# Altium schematic sheet MicroController.SchDoc: MicroController
size 292 x 193 mm; SheetNumber: 3; SheetTotal: 5
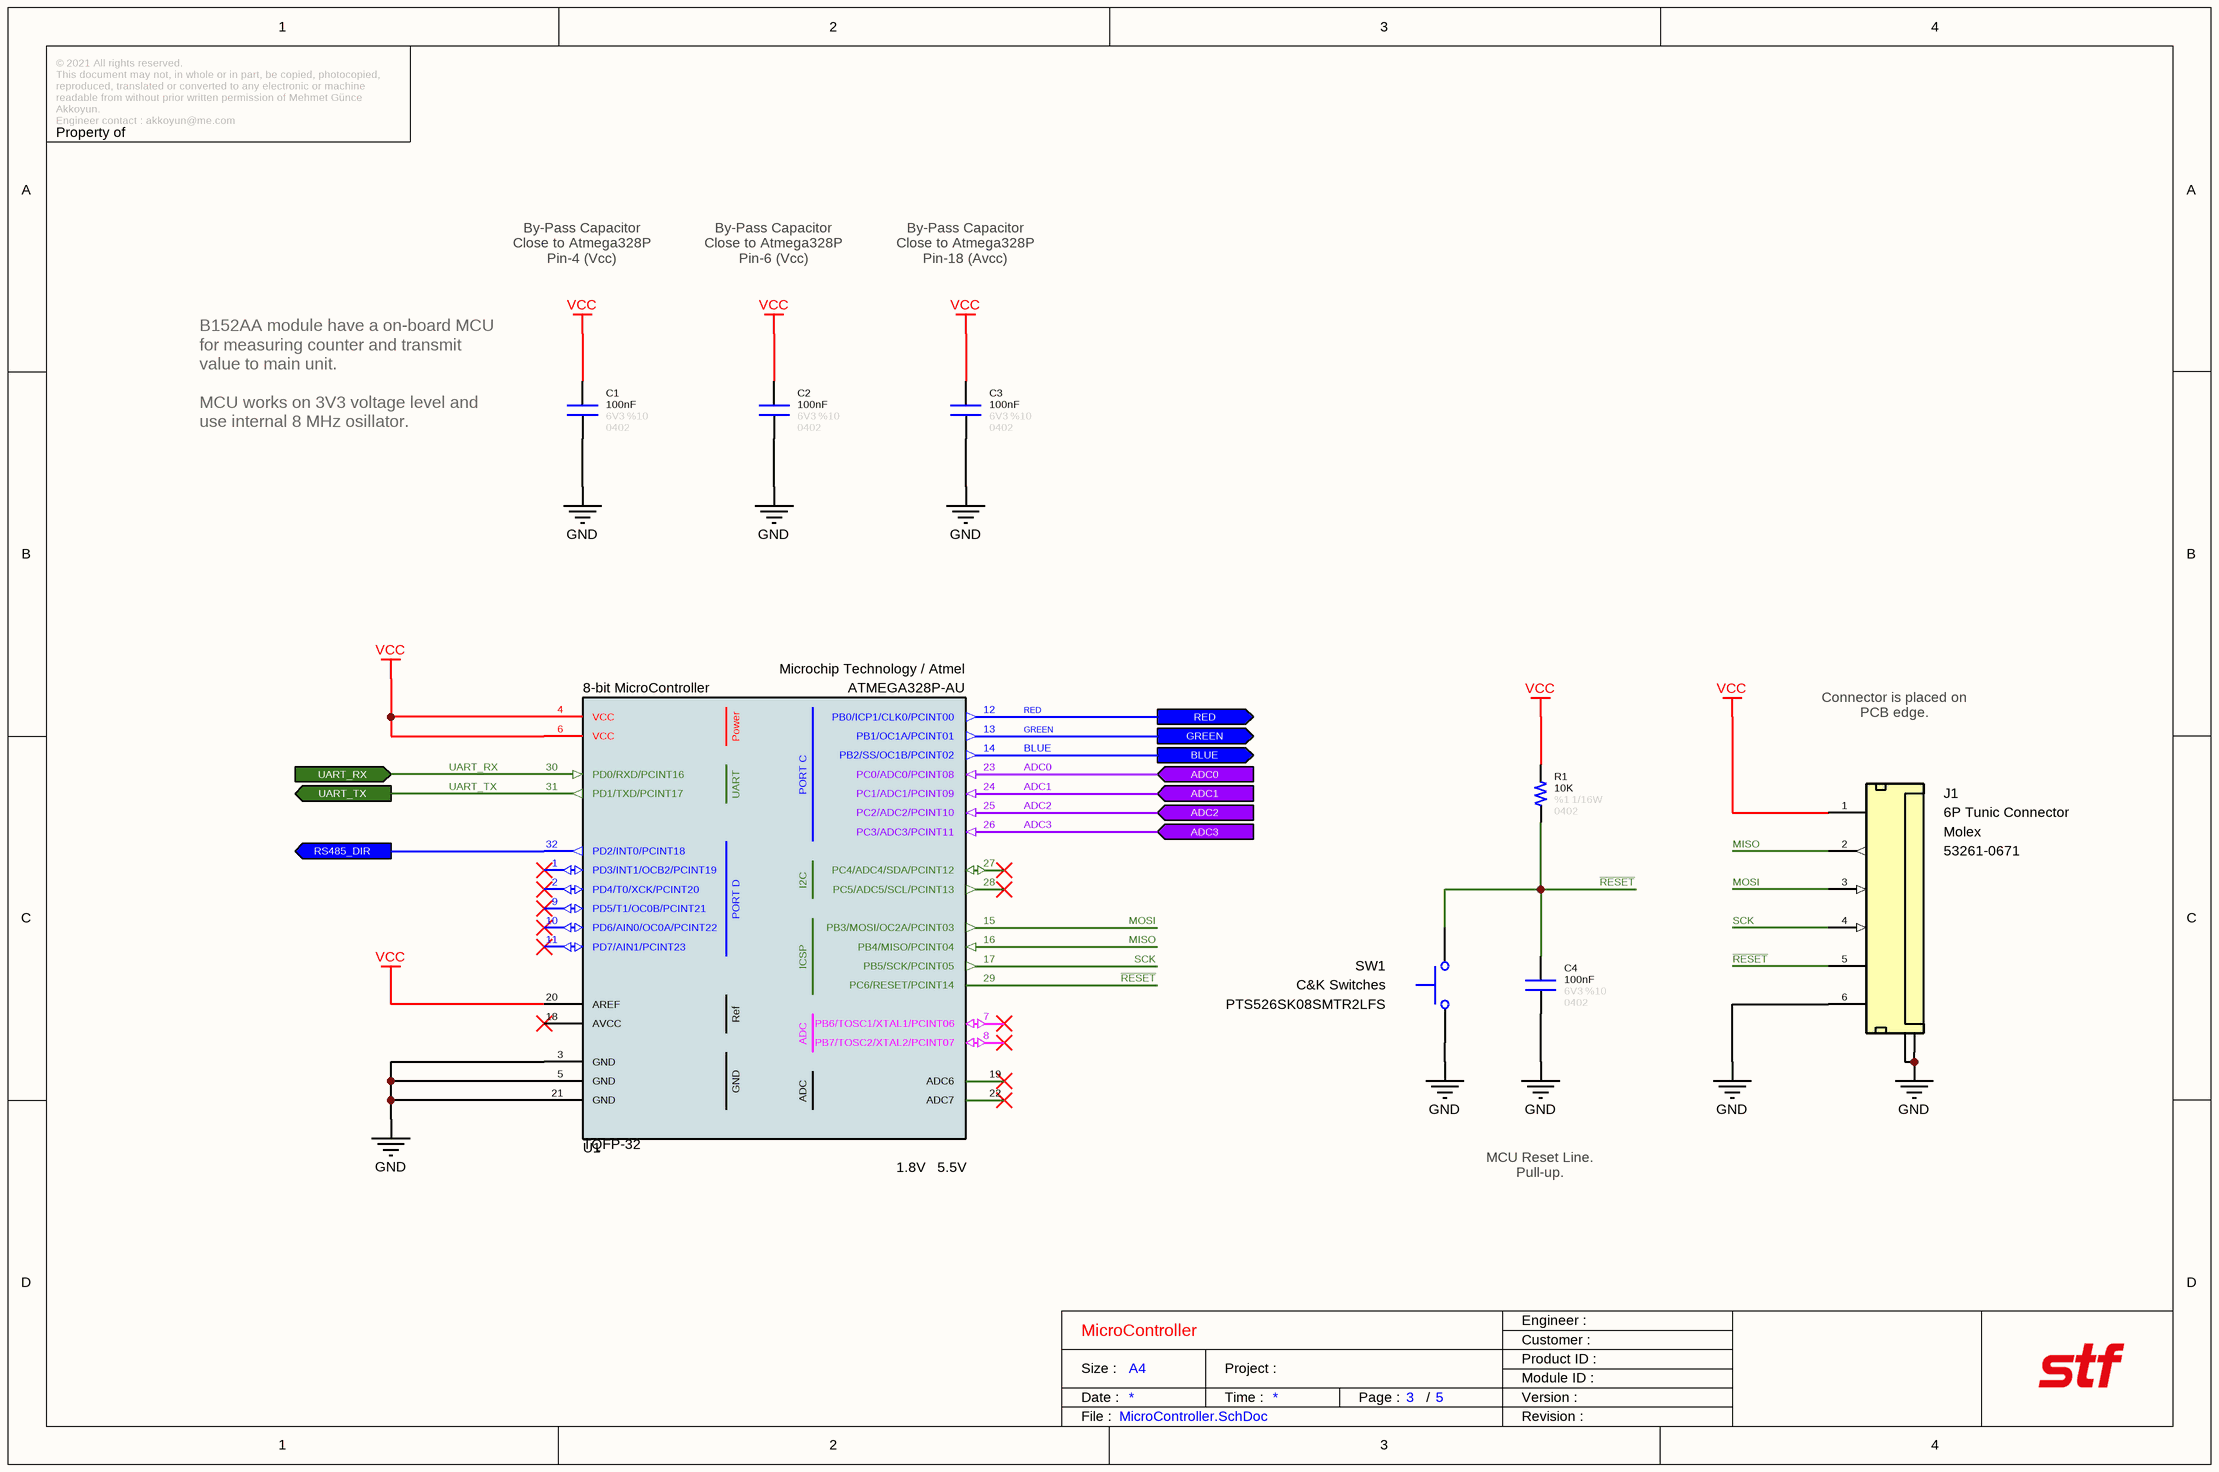
[diagram p0: MicroController.SchDoc]

## Parts
C1  value 100nF  Tolerance: %10  Voltage: 6V3  Case: 0402  [CAPACITOR_0402]  (hidden comment: Capacitor - 100nF [0402] (Ceramic))
C2  value 100nF  Tolerance: %10  Voltage: 6V3  Case: 0402  [CAPACITOR_0402]  (hidden comment: Capacitor - 100nF [0402] (Ceramic))
C3  value 100nF  Tolerance: %10  Voltage: 6V3  Case: 0402  [CAPACITOR_0402]  (hidden comment: Capacitor - 100nF [0402] (Ceramic))
C4  value 100nF  Tolerance: %10  Voltage: 6V3  Case: 0402  [CAPACITOR_0402]  (hidden comment: Capacitor - 100nF [0402] (Ceramic))
J1  6P Tunic Connector  Manufacturer Part Number: 53261-0671  Manufacturer Name: Molex  [Connector_Tunic 6P]
R1  value 10K  Tolerance: %1  Case: 0402  Power: 1/16W  [RESISTOR_0402]  (hidden comment: 10K - 0402 - %1 - 1/16W)
SW1  Manufacturer Name: C&K Switches  [PTS526_Switch]  (hidden comment: PTS526SK08SMTR2LFS)
U1  8-bit MicroController  Supply Voltage - Max: 5.5V  Supply Voltage - Min: 1.8V  Manufacturer Name: Microchip Technology / Atmel  Manufacturer Part Number: ATMEGA328P-AU  Case: TQFP-32  [TQFN-32]

## Ports
ADC0 (in), ADC1 (in), ADC2 (in), ADC3 (in), BLUE (out), GREEN (out), RED (out), RS485_DIR (out), UART_RX (in), UART_TX (out)

## Nets
GND: C1.1 C2.1 C3.1 C4.1 J1.6(M_DRV) J1.7(GND) J1.8(GND) SW1.1(NC) U1.3(GND) U1.5(GND) U1.21(GND)
VCC: C1.2 C2.2 C3.2 J1.1(VBAT) R1.2 U1.4(VCC) U1.6(VCC) U1.20(AREF)
ADC0: U1.23(PC0/ADC0/PCINT08) ; port ADC0
ADC1: U1.24(PC1/ADC1/PCINT09) ; port ADC1
ADC2: U1.25(PC2/ADC2/PCINT10) ; port ADC2
ADC3: U1.26(PC3/ADC3/PCINT11) ; port ADC3
BLUE: U1.14(PB2/SS/OC1B/PCINT02) ; port BLUE
GREEN: U1.13(PB1/OC1A/PCINT01) ; port GREEN
MISO: J1.2(M_DRV) U1.16(PB4/MISO/PCINT04)
MOSI: J1.3(M_DRV) U1.15(PB3/MOSI/OC2A/PCINT03)
~{RESET}: C4.2 J1.5(M_DRV) R1.1 SW1.2(COM) U1.29(PC6/RESET/PCINT14)
RED: U1.12(PB0/ICP1/CLK0/PCINT00) ; port RED
RS485_DIR: U1.32(PD2/INT0/PCINT18) ; port RS485_DIR
SCK: J1.4(M_DRV) U1.17(PB5/SCK/PCINT05)
UART_RX: U1.30(PD0/RXD/PCINT16) ; port UART_RX
UART_TX: U1.31(PD1/TXD/PCINT17) ; port UART_TX

Not connected (* = marked no-connect by the designer): U1 1(PD3/INT1/OCB2/PCINT19)* 2(PD4/T0/XCK/PCINT20)* 7(PB6/TOSC1/XTAL1/PCINT06)* 8(PB7/TOSC2/XTAL2/PCINT07)* 9(PD5/T1/OC0B/PCINT21)* 10(PD6/AIN0/OC0A/PCINT22)* 11(PD7/AIN1/PCINT23)* 18(AVCC)* 19(ADC6)* 22(ADC7)* 27(PC4/ADC4/SDA/PCINT12)* 28(PC5/ADC5/SCL/PCINT13)*

## Notes on the sheet
- By-Pass Capacitor
  Close to Atmega328P
  Pin-4 (Vcc)
- By-Pass Capacitor
  Close to Atmega328P
  Pin-6 (Vcc)
- By-Pass Capacitor
  Close to Atmega328P
  Pin-18 (Avcc)
- B152AA module have a on-board MCU for measuring counter and transmit value to main unit.
  MCU works on 3V3 voltage level and use internal 8 MHz osillator.
- Connector is placed on PCB edge.
- MCU Reset Line. Pull-up.
- © 2021 All rights reserved.
  This document may not, in whole or in part, be copied, photocopied, reproduced, translated or converted to any electronic or machine readable from without prior written permission of Mehmet Günce Akkoyun.
  Engineer contact : akkoyun@me.com
- Property of
- Engineer :
- Date :
- Size :
- A4
- Time :
- Project :
- Page :
- /
- Customer :
- Product ID :
- Module ID :
- Version :
- File :
- Revision :
- (in symbol IC - ATMEGA328P-AU) Power; PORT C; UART; I2C; PORT D; ICSP; Ref; ADC

## Library data of the parts
C1-C4 = Capacitor - 100nF [0402-6V3]: Capacitor - 100nF [0402-6V3] (Ceramic); Manufacturer Name: AVX; Manufacturer Part Number: 04026D104KAT4A; ComponentLink1Description: Mouser; ComponentLink1URL: https://www.mouser.com.tr/ProductDetail/AVX/04026D104KAT4A?qs=sGAEpiMZZMs0AnBnWHyRQPg4iYkCw7IMED%2F4kpqgf7w%3D; ComponentLink2Description: DataSheet; ComponentLink2URL: https://www.mouser.com.tr/datasheet/2/40/cx5r-776519.pdf
J1 = Connector - Mini Tunic 6P (1.25): Mini Tunic Connector with 6P; ROHS: Yes
R1 = Resistor - 10K [0402]: Thick Film Resistors - SMD 1/16 W 10 KOhm 1%; Manufacturer Name: Vishay; Manufacturer Part Number: CRCW040210K0FKED; ComponentLink1Description: DataSheet; ComponentLink1URL: https://www.mouser.com.tr/datasheet/2/427/dcrcwe3-1762152.pdf; ComponentLink2Description: Mouser; ComponentLink2URL: https://www.mouser.com.tr/ProductDetail/Vishay-Dale/CRCW040210K0FKED?qs=sGAEpiMZZMu61qfTUdNhG2DpbjADlD3GcalbOv9utCY%3D
SW1 = Switch - Push Button: Switch Tactile N.O. SPST Flush Round Button Gull Wing 0.05A 12VDC 200000Cycles 2.45N SMD T/R; Current Rating: 50 mA; Contact Form: SPST; Product Type: Tactile Switches; RoHS: Yes; Voltage Rating: 12 VDC; Case: SMD; Manufacturer Part Number: PTS526SK08SMTR2LFS
U1 = IC - ATMEGA328P-AU: 8-bit Microcontrollers - MCU 32KB In-system Flash 20MHz 1.8V-5.5V; Height: 1mm; ComponentLink1Description: DataSheet; ComponentLink1URL: http://ww1.microchip.com/downloads/en/DeviceDoc/ATmega48A-PA-88A-PA-168A-PA-328-P-DS-DS40002061A.pdf; ROHS: Yes; Minimum Operating Temperature: -40; Maximum Operating Temperature: +85; ComponentLink2Description: Mouser; ComponentLink2URL: https://www.mouser.com.tr/ProductDetail/Microchip-Technology-Atmel/ATMEGA328P-AU?qs=sGAEpiMZZMtVoztFdqDXO3RbBx7FKCmV; ComponentLink3Description: ProductPage; ComponentLink3URL: https://www.microchip.com/wwwproducts/en/ATmega328p